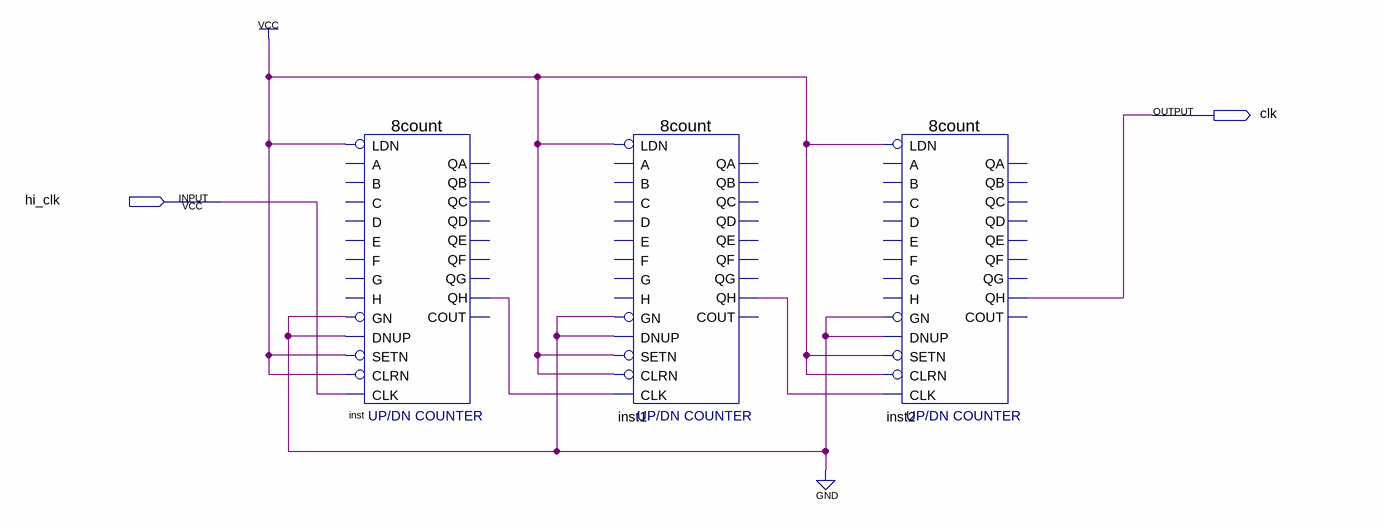
[diagram p0: schematic sheet]
// Quartus schematic freq_div.bdf as structural Verilog: 3 symbols, 2 pins
module freq_div (
  input  hi_clk,
  output clk
);

  wire inst1_qh, inst_qh;

  \8count  inst (
    .LDN(1'b1), .GN(1'b0), .CLRN(1'b1), .SETN(1'b1), .DNUP(1'b0), .CLK(hi_clk), .QH(inst_qh));  // open: B, A, D, C, E, F, H, G, QB, QA, QE, QD, QC, QG, QF, COUT
  \8count  inst1 (
    .LDN(1'b1), .GN(1'b0), .CLRN(1'b1), .SETN(1'b1), .DNUP(1'b0), .CLK(inst_qh), .QH(inst1_qh));  // open: B, A, D, C, E, F, H, G, QB, QA, QE, QD, QC, QG, QF, COUT
  \8count  inst2 (
    .LDN(1'b1), .GN(1'b0), .CLRN(1'b1), .SETN(1'b1), .DNUP(1'b0), .CLK(inst1_qh), .QH(clk));  // open: B, A, D, C, E, F, H, G, QB, QA, QE, QD, QC, QG, QF, COUT
endmodule
